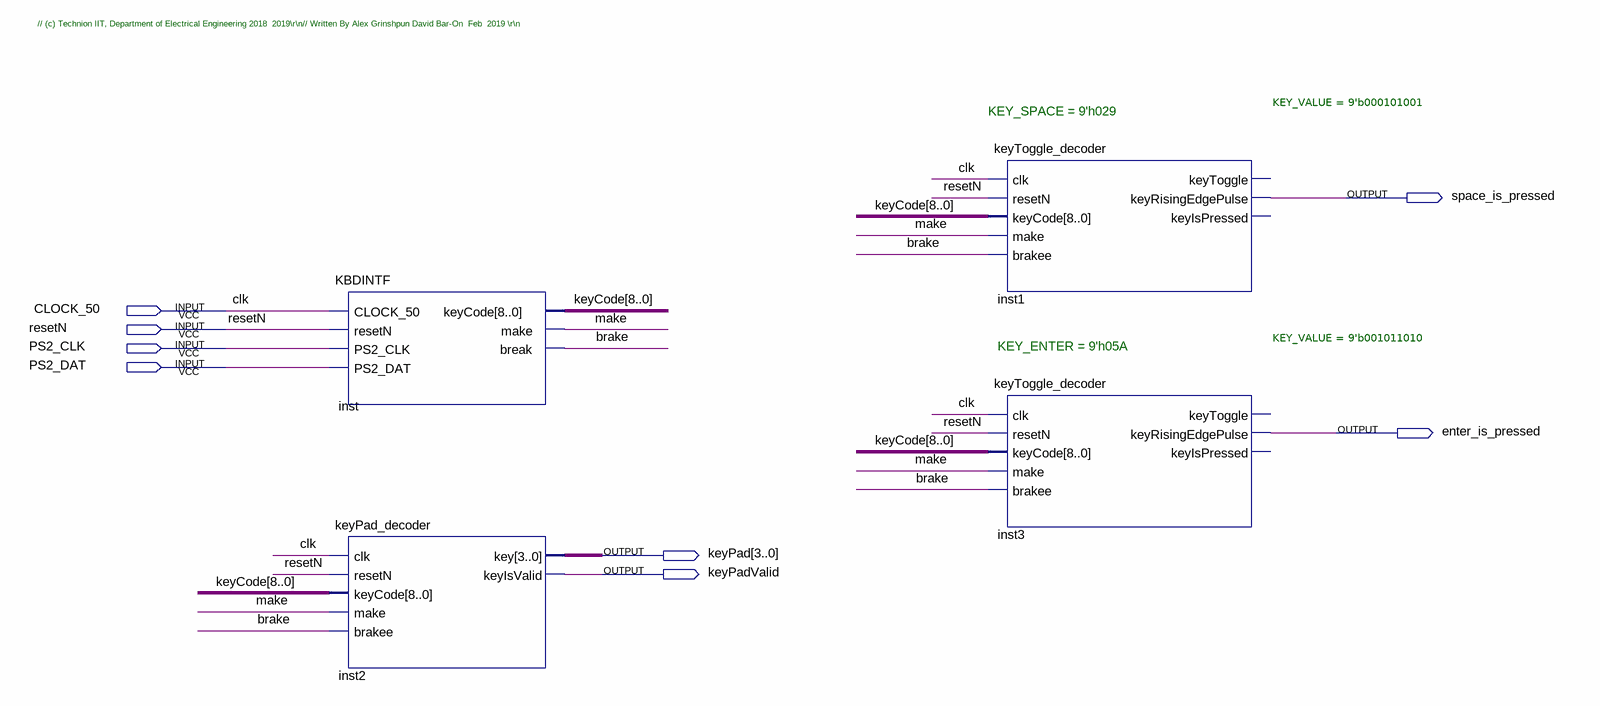
[diagram p0: schematic sheet]
// Quartus schematic TOP_KBD_DEMOALL.bdf as structural Verilog: 4 symbols, 8 pins
module TOP_KBD_DEMOALL (
  input  CLOCK_50,
  input  resetN,
  input  PS2_CLK,
  input  PS2_DAT,
  output space_is_pressed,
  output enter_is_pressed,
  output [3:0] keyPad,
  output keyPadValid
);

  wire brake, make;
  wire [8:0] keyCode;

  KBDINTF inst (
    .CLOCK_50(CLOCK_50), .resetN(resetN), .PS2_CLK(PS2_CLK), .PS2_DAT(PS2_DAT), .keyCode(keyCode),
    .make(make), .\break (brake));
  keyPad_decoder inst2 (
    .clk(CLOCK_50), .resetN(resetN), .keyCode(keyCode), .make(make), .brakee(brake), .key(keyPad),
    .keyIsValid(keyPadValid));
  keyToggle_decoder #(.KEY_VALUE(9'b000101001)) inst1 (
    .clk(CLOCK_50), .resetN(resetN), .keyCode(keyCode), .make(make), .brakee(brake),
    .keyRisingEdgePulse(space_is_pressed));  // open: keyToggle, keyIsPressed
  keyToggle_decoder #(.KEY_VALUE(9'b001011010)) inst3 (
    .clk(CLOCK_50), .resetN(resetN), .keyCode(keyCode), .make(make), .brakee(brake),
    .keyRisingEdgePulse(enter_is_pressed));  // open: keyToggle, keyIsPressed

  // Other names for the same wires on the sheet: clk = CLOCK_50

  // Notes on the sheet:
  //   // (c) Technion IIT, Department of Electrical Engineering 2018  2019\r\n// Written By Alex Grinshpun David Bar-On  Feb  2019 \r\n
  //   KEY_SPACE = 9'h029
  //   KEY_ENTER = 9'h05A
endmodule
